# EAGLE schematic Split Board RFB (EAGLE 9.7.0)
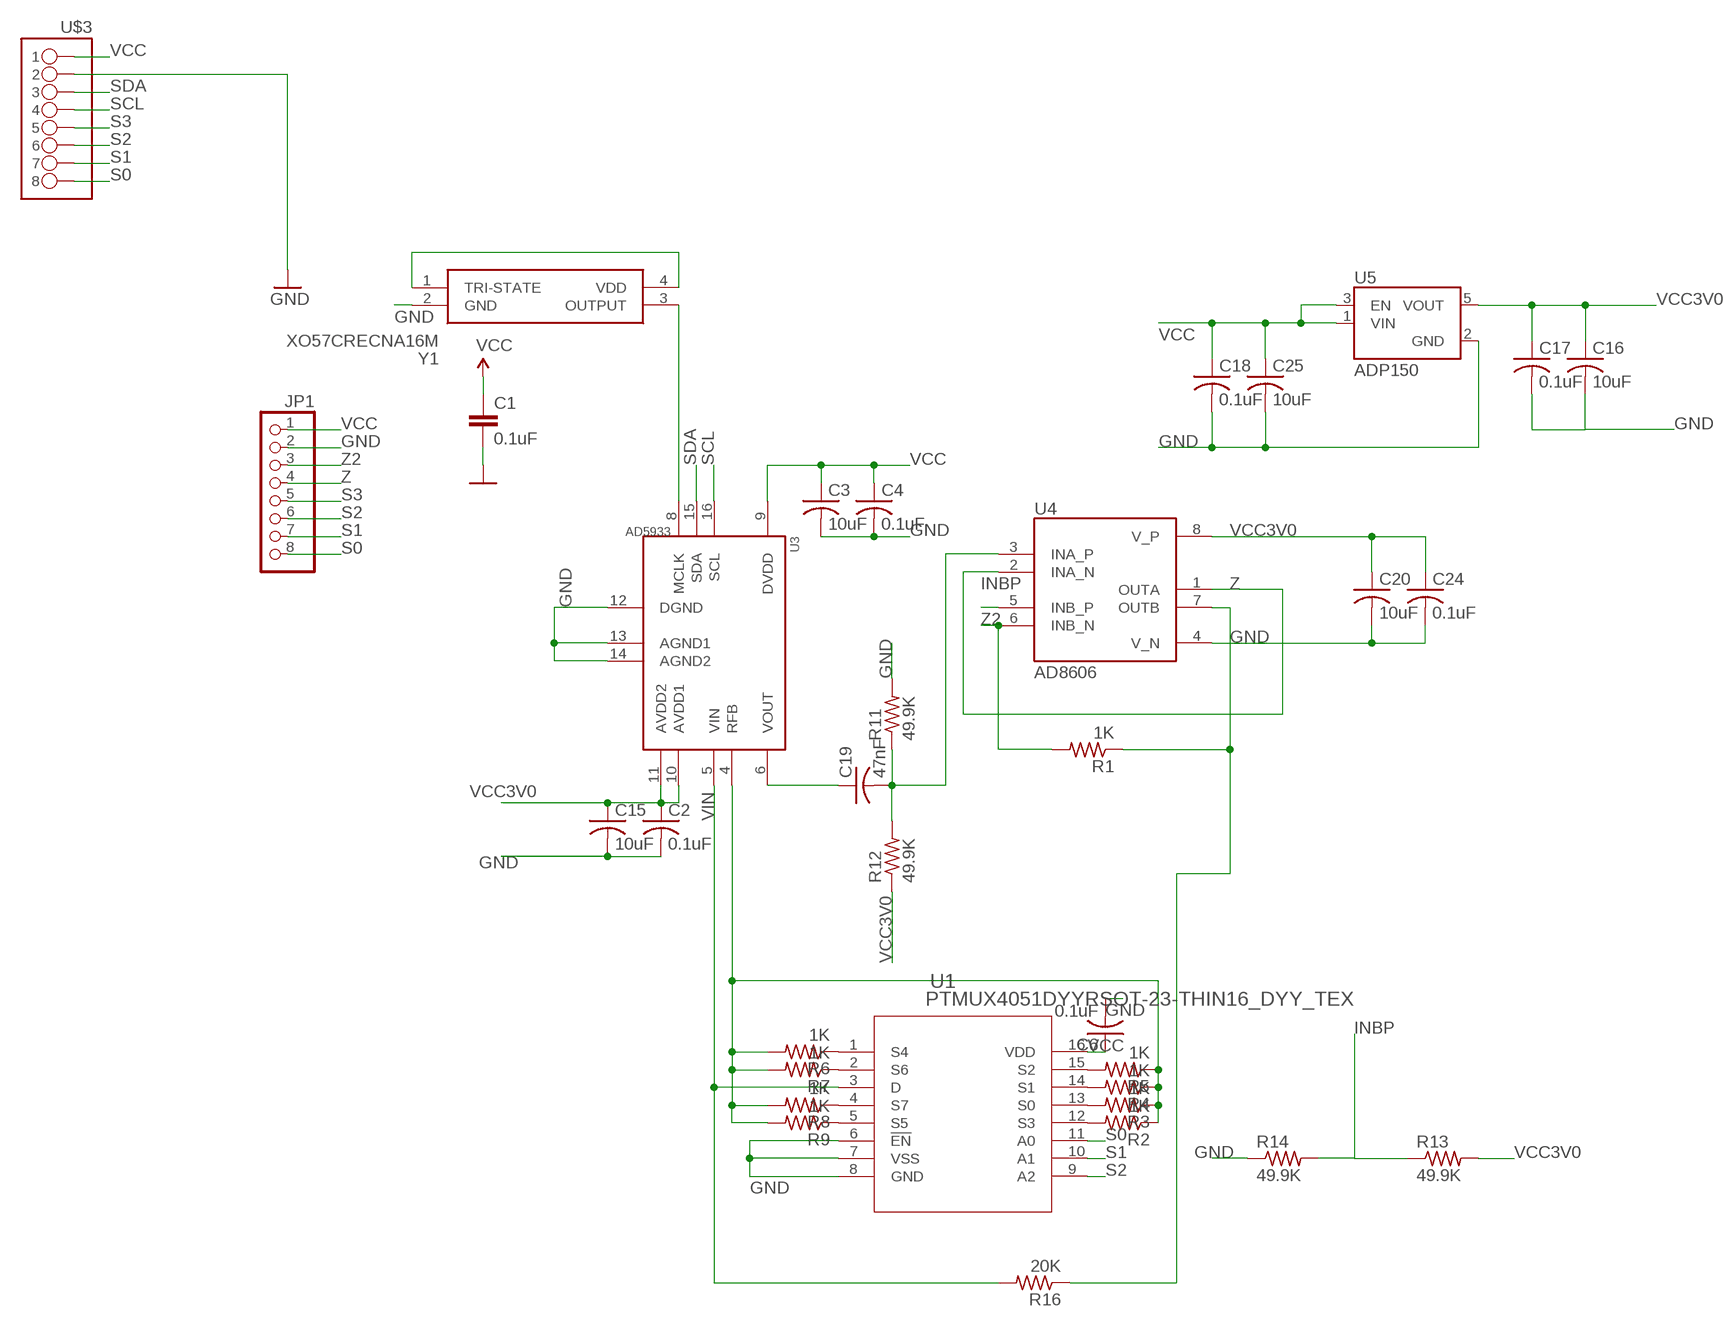
[diagram p0: schematic, sheet 1]

## Parts
C1  0.1uF  0.1UF-0603-25V-(+80/-20%)  [0603]
C2  0.1uF  C-USC0805K  [C0805K]
C3  10uF  C-USC0805K  [C0805K]
C4  0.1uF  C-USC0805K  [C0805K]
C6  0.1uF  C-USC0805K  [C0805K]
C15  10uF  C-USC0805K  [C0805K]
C16  10uF  C-USC0805K  [C0805K]
C17  0.1uF  C-USC0805K  [C0805K]
C18  0.1uF  C-USC0805K  [C0805K]
C19  47nF  C-USC0805K  [C0805K]
C20  10uF  C-USC0805K  [C0805K]
C24  0.1uF  C-USC0805K  [C0805K]
C25  10uF  C-USC0805K  [C0805K]
JP1  PINHD-1X8  [1X08]
R1  1K  R-US_R0603  [R0603]
R2  1K  R-US_R0603  [R0603]
R3  1K  R-US_R0603  [R0603]
R4  1K  R-US_R0603  [R0603]
R5  1K  R-US_R0603  [R0603]
R6  1K  R-US_R0603  [R0603]
R7  1K  R-US_R0603  [R0603]
R8  1K  R-US_R0603  [R0603]
R9  1K  R-US_R0603  [R0603]
R11  49.9K  R-US_R0603  [R0603]
R12  49.9K  R-US_R0603  [R0603]
R13  49.9K  R-US_R0603  [R0603]
R14  49.9K  R-US_R0603  [R0603]
R16  20K  R-US_R0603  [R0603]
U1  PTMUX4051DYYRSOT-23-THIN16_DYY_TEX  [SOT-23-THIN16_DYY_TEX]
U3  AD5933  [SSOP16]
U4  AD8606  [SOIC-8]
U5  ADP150  [SOT95P280X100-5N]
U$3  PINHD-1X08_1X08M  [1X08]
Y1  XO57CRECNA16M  [XO57CRECNA16M]

## Nets
GND: C1.2 C2.2 C3.2 C4.2 C6.2 C15.2 C16.2 C17.2 C18.2 C20.2 C24.2 C25.2 JP1.2 R11.2 R14.1 U1.6(!EN) U1.7(VSS) U1.8(GND) U3.12(DGND) U3.13(AGND1) U3.14(AGND2) U4.4(V_N) U5.2(GND) U$3.2 Y1.2(GND)
INBP: R13.1 R14.2 U4.5(INB_P)
N$1: C19.1 U3.6(VOUT)
N$2: R2.2 U1.12(S3)
N$3: C19.2 R11.1 R12.2 U4.3(INA_P)
N$5: R2.1 R3.1 R4.1 R5.1 R6.2 R7.2 R8.2 R9.2 U3.4(RFB)
N$6: R3.2 U1.13(S0)
N$7: R4.2 U1.14(S1)
N$8: R5.2 U1.15(S2)
N$9: R6.1 U1.1(S4)
N$10: R7.1 U1.2(S6)
N$11: R1.1 R16.1 U4.7(OUTB)
N$12: R8.1 U1.4(S7)
N$13: R9.1 U1.5(S5)
N$14: U3.8(MCLK) Y1.3(OUTPUT)
S0: JP1.8 U1.11(A0) U$3.8
S1: JP1.7 U1.10(A1) U$3.7
S2: JP1.6 U1.9(A2) U$3.6
S3: JP1.5 U$3.5
SCL: U3.16(SCL) U$3.4
SDA: U3.15(SDA) U$3.3
VCC: C1.1 C3.1 C4.1 C6.1 C18.1 C25.1 JP1.1 U1.16(VDD) U3.9(DVDD) U5.1(VIN) U5.3(EN) U$3.1 Y1.1(TRI-STATE) Y1.4(VDD)
VCC3V0: C2.1 C15.1 C16.1 C17.1 C20.1 C24.1 R12.1 R13.2 U3.10(AVDD1) U3.11(AVDD2) U4.8(V_P) U5.5(VOUT)
VIN: R16.2 U1.3(D) U3.5(VIN)
Z: JP1.4 U4.1(OUTA) U4.2(INA_N)
Z2: JP1.3 R1.2 U4.6(INB_N)

## Library data of the parts
C1 = SparkFun-Capacitors:0.1UF: 0.1µF ceramic capacitors A capacitor is a passive two-terminal electrical component used to store electrical energy temporarily in an electric field.; PROD_ID: CAP-00810
C2-C4 C6 C15-C20 C24 C25 = rcl:C-US: CAPACITOR, American symbol; SPICEPREFIX: C
JP1 = pinhead:PINHD-1X8: PIN HEADER
R1-R9 R11-R14 R16 = rcl:R-US_: RESISTOR, American symbol; SPICEPREFIX: R
U1 = 2025-11-25_04-52-31_Library:PTMUX4051DYYR; COPYRIGHT: Copyright (C) 2025 Ultra Librarian. All rights reserved.; DESCRIPTION: ±12-V, 8:1, one-channel multiplexer with 1.8-V compatible logic 16-SOT-23-THIN -55 to 125; MANUFACTURER_NAME: Texas Instruments; MANUFACTURER_PART_NUMBER: PTMUX4051DYYR
U3 = PMODIA:AD5933: 1 MSPS, 12-Bit Impedance Converter, Network Analyzer Applications: Electrochemical analysis Bioelectrical impedance analysis Impedance spectroscopy Complex impedance measurement Corrosion monitoring and protection equipment Biomedical and automotive sensors Proximity sensing Nondestructive testing Material property analysis Fuel/battery cell condition monitoring source <http://www.analog.com/static/imported-files/data_sheets/AD5933.pdf>
U4 = Updated PMODIA:AD8606: Operational amplifier; 10MHz; 2.7÷5VDC; Channels: 2; SO8 Check availability <https://pricing.snapeda.com/parts/AD8606ARZ/Analog%20Devices/view-part?ref=eda>; AVAILABILITY: In Stock; CHECK_PRICES: https://www.snapeda.com/parts/AD8606ARZ/Analog+Devices/view-part/?ref=eda; DESCRIPTION: Precision, Low Noise, RRIO, CMOS Op Amp (Dual); MF: Analog Devices; MP: AD8606ARZ; PACKAGE: SOIC-8 Analog Devices; PRICE: None; PURCHASE-URL: https://www.snapeda.com/api/url_track_click_mouser/?unipart_id=43414&manufacturer=Analog Devices&part_name=AD8606ARZ&search_term=ad8606; SNAPEDA_LINK: https://www.snapeda.com/parts/AD8606ARZ/Analog+Devices/view-part/?ref=snap
U5 = Updated PMODIA:ADP150: IC REG LINEAR 2V 150MA 5TSOT Check availability <https://pricing.snapeda.com/parts/ADP150AUJZ-2.0-R7/Analog%20Devices/view-part?ref=eda>; AVAILABILITY: In Stock; CHECK_PRICES: https://www.snapeda.com/parts/ADP150AUJZ-2.0-R7/Analog+Devices/view-part/?ref=eda; DESCRIPTION: Ultralow Noise, 150 mA CMOS Linear Regulator; MF: Analog Devices; MP: ADP150AUJZ-2.0-R7; PACKAGE: TSOT-5 Analog Devices; PRICE: None; PURCHASE-URL: https://www.snapeda.com/api/url_track_click_mouser/?unipart_id=1225884&manufacturer=Analog Devices&part_name=ADP150AUJZ-2.0-R7&search_term=adp150; SNAPEDA_LINK: https://www.snapeda.com/parts/ADP150AUJZ-2.0-R7/Analog+Devices/view-part/?ref=snap
U$3 = Tinkercad:PINHD-1X08
Y1 = XO57CRECNA16M:XO57CRECNA16M: Standard Clock Oscillators 16MHz Source: Datasheet; DESCRIPTION: Standard Clock Oscillators 16MHz; HEIGHT: 1.9mm; MANUFACTURER_NAME: Vishay; MANUFACTURER_PART_NUMBER: XO57CRECNA16M; MOUSER_PART_NUMBER: 73-XOSM57BRE16MHZ; MOUSER_PRICE-STOCK: https://www.mouser.co.uk/ProductDetail/Vishay-Dale/XO57CRECNA16M?qs=VsPLLCyI2ZLtoU%252BQ7ye5Yg%3D%3D